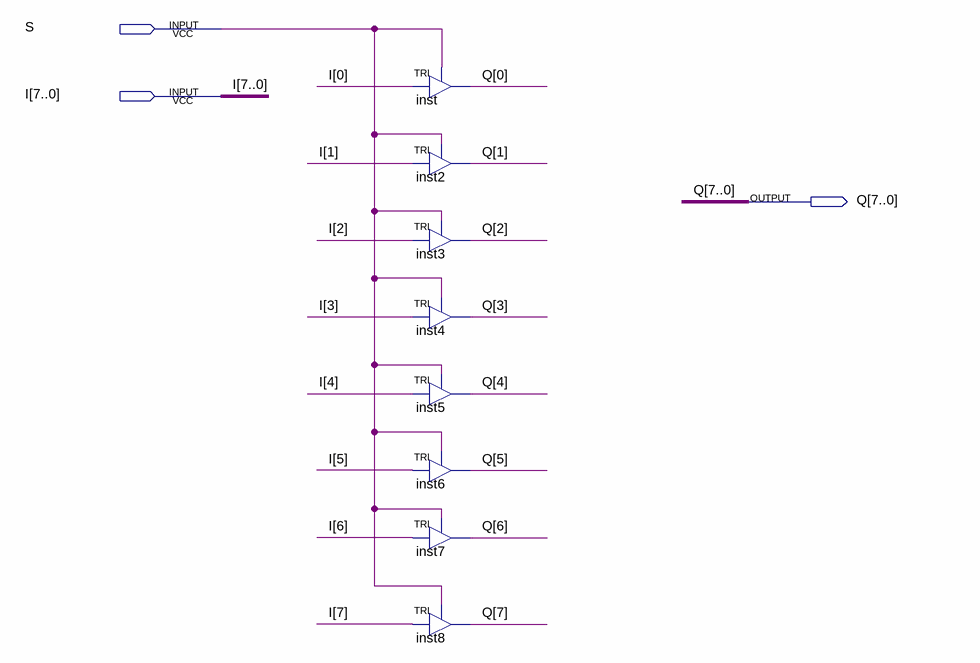
[diagram p0: schematic sheet]
// Quartus schematic TRI_8BIT.bdf as structural Verilog: 8 symbols, 3 pins
module TRI_8BIT (
  input  S,
  input  [7:0] I,
  output [7:0] Q
);

  TRI inst (.IN(I[0]), .OE(S), .OUT(Q[0]));
  TRI inst2 (.IN(I[1]), .OE(S), .OUT(Q[1]));
  TRI inst3 (.IN(I[2]), .OE(S), .OUT(Q[2]));
  TRI inst4 (.IN(I[3]), .OE(S), .OUT(Q[3]));
  TRI inst5 (.IN(I[4]), .OE(S), .OUT(Q[4]));
  TRI inst6 (.IN(I[5]), .OE(S), .OUT(Q[5]));
  TRI inst7 (.IN(I[6]), .OE(S), .OUT(Q[6]));
  TRI inst8 (.IN(I[7]), .OE(S), .OUT(Q[7]));
endmodule
